# EAGLE design dynext_v0.2 (EAGLE 6.5.0)
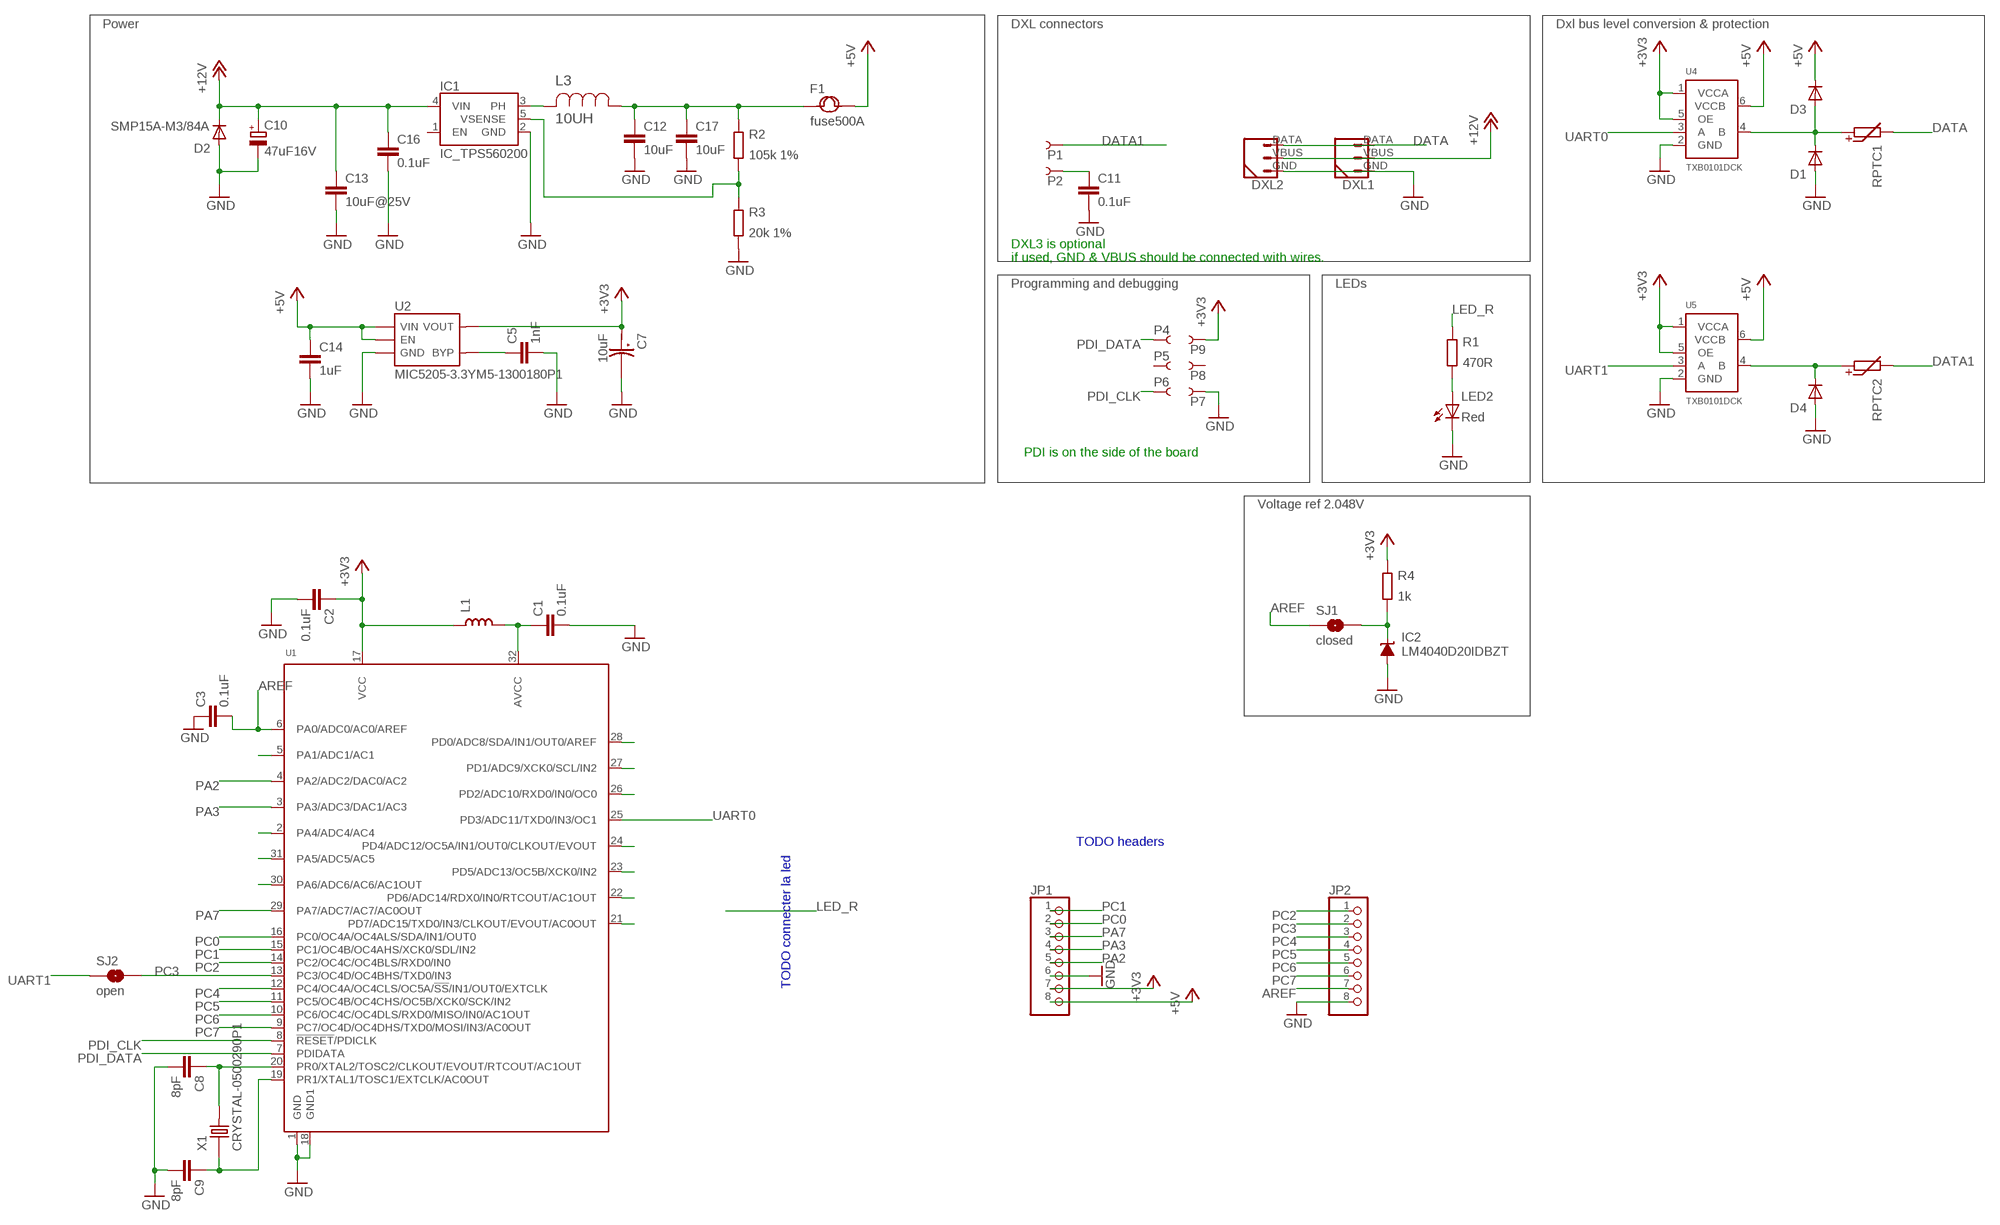
[diagram p0: schematic, sheet 1]

## Parts
C1  0.1uF  C0402  [0402_N]
C2  0.1uF  C0402  [0402_N]
C3  0.1uF  C0402  [0402_N]
C5  1nF  C0402  [0402_N]
C7  10uF  C-POLAR-A  [AVX-A]
C8  8pF  C0402  [0402_N]
C9  8pF  C0402  [0402_N]
C10  47uF16V  CPOL-EUUD-5X5,8  [UD-5X5,8_NICHICON]
C11  0.1uF  C0402  [0402_N]
C12  10uF  C0805  [0805_N]
C13  10uF@25V  C0805  [0805_N]
C14  1uF  C0402  [0402_N]
C16  0.1uF  C0402  [0402_N]
C17  10uF  C0805  [0805_N]
D1  DIODE-SOD523  [SOD-523_N]
D2  SMP15A-M3/84A  DIODE-SMP  [DO-220AA]
D3  DIODE-SOD523  [SOD-523_N]
D4  DIODE-SOD523  [SOD-523_N]
DXL1  DYNAMIXEL_3POS-T  [DYNAMIXEL_3POS_TOP]
DXL2  DYNAMIXEL_3POS-T  [DYNAMIXEL_3POS_TOP]
F1  fuse500A  FUSE-1206  [F1206]
IC1  IC_TPS560200  [SOT-23-5_N]
IC2  LM4040D20IDBZT  LM4041A12DBZ  [DBZ_R-PDSO-G3]
JP1  PINHD-1X8R  [1X08_ROUND]
JP2  PINHD-1X8R  [1X08_ROUND]
L1  L0603  [0603_N]
L3  10UH  ELL4LG100MA-4XG  [IND_ELL4XG]
LED2  Red  LED0603  [D_0603_N]
P1  PIN_SMD_2X2.5  [PIN_SMD_2X2.5]
P2  PIN_SMD_2X2.5  [PIN_SMD_2X2.5]
P4  PIN_SMD_2X2.5  [PIN_SMD_2X2.5]
P5  PIN_SMD_1X1  [PIN_SMD_1X1]
P6  PIN_SMD_2X2.5  [PIN_SMD_2X2.5]
P7  PIN_SMD_2X2.5  [PIN_SMD_2X2.5]
P8  PIN_SMD_1X1  [PIN_SMD_1X1]
P9  PIN_SMD_2X2.5  [PIN_SMD_2X2.5]
R1  470R  R0402  [0402_N]
R2  105k 1%  R0402  [0402_N]
R3  20k 1%  R0402  [0402_N]
R4  1k  R0402  [0402_N]
RPTC1  R-PTC0603  [0603_N]
RPTC2  R-PTC0603  [0603_N]
SJ1  closed  SOLDERJUMPER2_TRACE2  [SJ_2S-TRACE2]
SJ2  open  SOLDERJUMPER2NO  [SJ_2S-NO]
U1  ATXMEGAE5-MU_MOD  [QFN-32_50P_L_MOD]
U2  MIC5205-3.3YM5-1300180P1  [SOT23-5]
U4  TXB0101DCK  [SC70-6]
U5  TXB0101DCK  [SC70-6]
X1  CRYSTAL-0500290P1  [2P-SMD-5.0X3.2]

## Nets
+3V3: C2.1 C7.+ JP1.7 L1.1 P9.PIN R4.2 U1.17(VCC) U2.5(VOUT) U4.1(VCCA) U4.5(OE) U5.1(VCCA) U5.5(OE)
+5V: C14.1 D3.C F1.2 JP1.8 U2.1(VIN) U2.3(EN) U4.6(VCCB) U5.6(VCCB)
+12V: C10.+ C13.1 C16.1 D2.C DXL1.VBUS DXL2.VBUS IC1.4(VIN)
AREF: C3.2 JP2.7 SJ1.1 U1.6(PA0/ADC0/AC0/AREF)
DATA: DXL1.DATA DXL2.DATA RPTC1.2
DATA1: P1.PIN RPTC2.2
GND: C1.2 C2.2 C3.1 C5.2 C7.- C8.2 C9.2 C10.- C11.2 C12.2 C13.2 C14.2 C16.2 C17.2 D1.A D2.A D4.A DXL1.GND DXL2.GND IC1.2(GND) IC2.2(A) JP1.6 JP2.8 LED2.C P7.PIN R3.1 U1.1(GND) U1.18(GND1) U2.2(GND) U4.2(GND) U5.2(GND)
LED_R: R1.2
N$1: C11.1 P2.PIN
N$2: C1.1 L1.2 U1.32(AVCC)
N$3: LED2.A R1.1
N$4: C8.1 U1.20(PR0/XTAL2/TOSC2/CLKOUT/EVOUT/RTCOUT/AC1OUT) X1.2
N$5: C5.1 U2.4(BYP)
N$6: C9.1 U1.19(PR1/XTAL1/TOSC1/EXTCLK/AC0OUT) X1.1
N$7: D1.C D3.A RPTC1.1 U4.4(B)
N$8: U1.5(PA1/ADC1/AC1)
N$9: U1.2(PA4/ADC4/AC4)
N$10: U1.31(PA5/ADC5/AC5)
N$11: D4.C RPTC2.1 U5.4(B)
N$12: U1.30(PA6/ADC6/AC6/AC1OUT)
N$13: U1.21(PD7/ADC15/TXD0/IN3/CLKOUT/EVOUT/AC0OUT)
N$14: C12.1 C17.1 F1.1 L3.1 R2.2
N$15: IC1.5(VSENSE) R2.1 R3.2
N$16: U1.22(PD6/ADC14/RDX0/IN0/RTCOUT/AC1OUT)
N$17: U1.23(PD5/ADC13/OC5B/XCK0/IN2)
N$18: U1.24(PD4/ADC12/OC5A/IN1/OUT0/CLKOUT/EVOUT)
N$19: U1.26(PD2/ADC10/RXD0/IN0/OC0)
N$20: U1.27(PD1/ADC9/XCK0/SCL/IN2)
N$21: U1.28(PD0/ADC8/SDA/IN1/OUT0/AREF)
N$29: IC2.1(C) R4.1 SJ1.2
PA2: JP1.5 U1.4(PA2/ADC2/DAC0/AC2)
PA3: JP1.4 U1.3(PA3/ADC3/DAC1/AC3)
PA7: JP1.3 U1.29(PA7/ADC7/AC7/AC0OUT)
PC0: JP1.2 U1.16(PC0/OC4A/OC4ALS/SDA/IN1/OUT0)
PC1: JP1.1 U1.15(PC1/OC4B/OC4AHS/XCK0/SDL/IN2)
PC2: JP2.1 U1.14(PC2/OC4C/OC4BLS/RXD0/IN0)
PC3: JP2.2 SJ2.2 U1.13(PC3/OC4D/OC4BHS/TXD0/IN3)
PC4: JP2.3 U1.12(PC4/OC4A/OC4CLS/OC5A/!SS!/IN1/OUT0/EXTCLK)
PC5: JP2.4 U1.11(PC5/OC4B/OC4CHS/OC5B/XCK0/SCK/IN2)
PC6: JP2.5 U1.10(PC6/OC4C/OC4DLS/RXD0/MISO/IN0/AC1OUT)
PC7: JP2.6 U1.9(PC7/OC4D/OC4DHS/TXD0/MOSI/IN3/AC0OUT)
PDI_CLK: P6.PIN U1.8(!RESET!/PDICLK)
PDI_DATA: P4.PIN U1.7(PDIDATA)
PH_L: IC1.3(PH) L3.2
UART0: U1.25(PD3/ADC11/TXD0/IN3/OC1) U4.3(A)
UART1: SJ2.1 U5.3(A)
Unconnected: IC1.1(EN) P5.P$1 P8.P$1

## Notes on the sheet
- Power | DXL connectors | Dxl bus level conversion & protection
- DXL3 is optional 
  if used, GND & VBUS should be connected with wires.
- Programming and debugging | LEDs
- PDI is on the side of the board
- Voltage ref 2.048V
- TODO headers
- TODO connecter la led

## Library data of the parts
C1-C3 C5 C8 C9 C11-C14 C16 C17 = Xevelabs:C: Non-polarized Capacitor
C7 = OPL:C-POLAR*
C10 = rcl:CPOL-EU: POLARIZED CAPACITOR, European symbol
D1-D4 = Xevelabs:DIODE: Diode
DXL1 DXL2 = Xevelabs:DYNAMIXEL_3POS
F1 = OPL:FUSE*
IC1 = Xevelabs:IC_TPS560200
IC2 = texas:LM4041: PRECISION MICROPOWER SHUNT VOLTAGE REFERENCE Source: http://focus.ti.com/lit/ds/slcs146e/slcs146e.pdf; MPN: LM4041A12IDBZR; OC_FARNELL: 1407949; OC_NEWARK: 58K5875
JP1 JP2 = pinhead:PINHD-1X8: PIN HEADER
L1 = Xevelabs:L
L3 = Panasonic-ELL:ELL: Choke Coils; MPN: ELL4LG100MA; OC_FARNELL: 1717444; OC_NEWARK: 15R1065; PACKAGE-SIZE: 3.8X3.8X1.8MM; SUPPLIER: PANASONIC
LED2 = Xevelabs:LED: LED
P1 P2 P4-P9 = Xevelabs:PIN
R1-R4 = Xevelabs:R: Resistor
RPTC1 RPTC2 = Xevelabs:R-PTC: PTC (Positive Temperature Coefficient) Resistor
SJ1 SJ2 = Xevelabs:SOLDERJUMPER2: Solder Jumper Standard SMD solder jumper. Used to automate production. Two varients : Normally Open and Normally Closed are the same, but have different paste layers. NC will have a large amount of paste and should jumper during reflow.
U1 = dynext_v0.1:ATXMEGAE5
U2 = OPL:MIC5205-3.3YM5: The MIC5205 is an efficient linear voltage regulator with ultra-low-noise output, very low dropout voltage (typically 17mV at light loads and 165mV at 150mA), and very low ground current (600µA at 100mA output). The MIC5205 offers better than 1% initial accuracy. datasheet here: http://www.micrel.com/product-info/prod/5205.shtml
U4 U5 = MWquad_stuff:TXB0101
X1 = OPL:CRYSTAL*

## Board
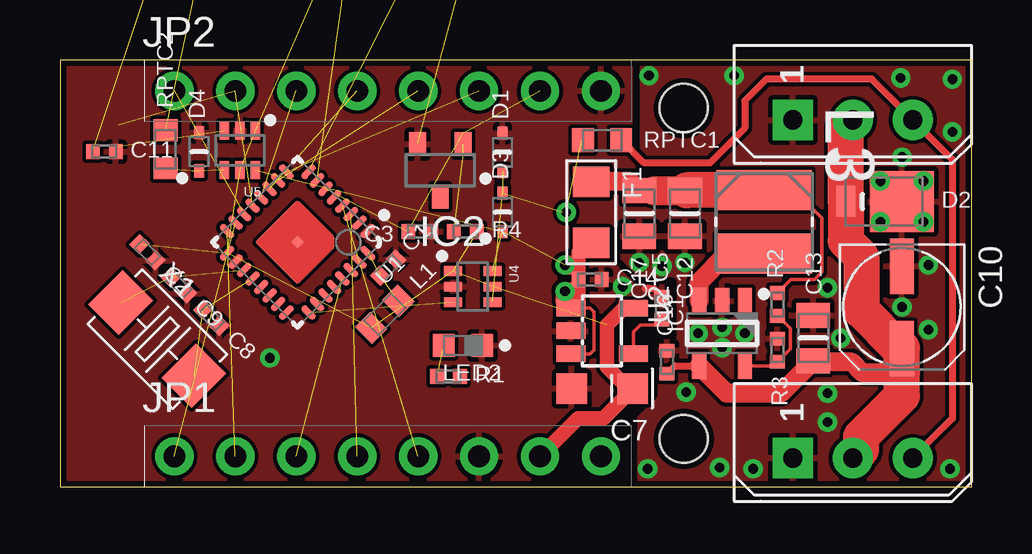
[diagram p1: board, top side]
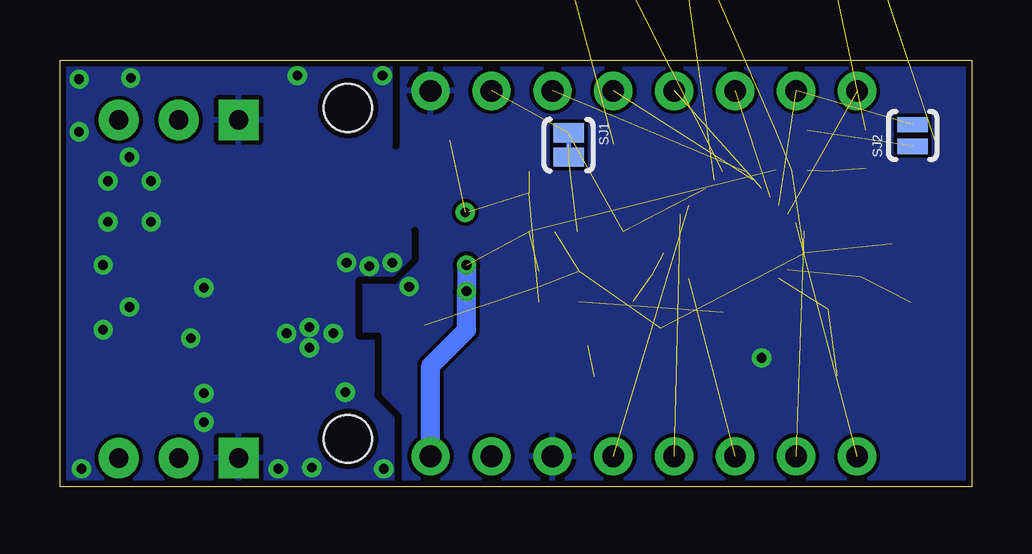
[diagram p2: board, bottom side, seen from below]

Size 38 x 17.8 mm. Coordinates in mm from the lower left corner, seen from the top.
Outline: 0,0 38,0 38,17.8 0,17.8 0,0
Copper layers (1*2*3*16): Top 0.035mm / dielectric 0.2mm / Route2 0.035mm / dielectric 1mm / Route3 0.035mm / dielectric 0.2mm / Bottom 0.035mm
Design rules "Xevelabs_6mil_eurocircuits *": minimum track width 0.15mm, minimum drill 0.25mm, track to track 0.155mm, track to pad 0.155mm, pad to pad 0.155mm, via to via 0.155mm, smd to smd 0mil, copper to edge 0.25mm, drill to drill 0.25mm, minimum pad ring 0mil, minimum via ring 0.2mm, stop-mask expansion 0mil, vias tented up to drill 100mil, thermal gap 0.2mm
Holes 2 mm at 26,2 26,15.8
tRestrict: 9 lines
bRestrict: 9 lines

### Footprints (pad centres in the part's own frame; a part is rotated, then mirrored left to right if it is on the bottom)
0402_N = smd 0.57 x 0.62: 1 -0.48,0; 2 0.48,0
AVX-A = smd 1.27 x 1.27: + -1.27,0; - 1.27,0
UD-5X5,8_NICHICON = smd 2.3 x 1: + 1.725,0; - -1.7,0
0805_N = smd 1.05 x 1.4: 1 -0.95,0; 2 0.95,0
SOD-523_N = smd 0.55 x 0.42: A 0.8,0; C -0.8,0
DO-220AA = smd 2.67 x 2.54: A 0.7,0 | smd 0.76 x 1.27: C -1.65,0
DYNAMIXEL_3POS_TOP = drill 0.8 pad 1.676: DATA 1.8,2.45; VBUS 1.8,4.95 | drill 0.8 pad 1.676 square: GND 1.8,7.45
F1206 = smd 1.27 x 1.524: 1 -1.27,0; 2 1.27,0
SOT-23-5_N = smd 1.1 x 0.6: 1 -1.35,0.95; 2 -1.35,0; 3 -1.35,-0.95; 4 1.35,-0.95; 5 1.35,0.95
DBZ_R-PDSO-G3 = smd 0.7 x 1: 1 -0.95,-1.1; 2 0.95,-1.1; 3 0,1.1
1X08_ROUND = drill 0.9 pad 1.6: 1 -8.89,0; 2 -6.35,0; 3 -3.81,0; 4 -1.27,0; 5 1.27,0; 6 3.81,0; 7 6.35,0; 8 8.89,0
0603_N = smd 0.9 x 1: 1 -0.8,0; 2 0.8,0
IND_ELL4XG = smd 1.651 x 3.988: 1 -1.321,0; 2 1.321,0
D_0603_N = smd 0.9 x 0.95: A 0.8,0; C -0.8,0
PIN_SMD_2X2.5 = smd 2.5 x 2: PIN 0,0
PIN_SMD_1X1 = smd 1 x 1: P$1 0,0
SJ_2S-TRACE2 = smd 0.8 x 1.27: 1 -0.508,0; 2 0.508,0
SJ_2S-NO = smd 0.635 x 1.27: 1 -0.45,0; 2 0.45,0
QFN-32_50P_L_MOD = smd 0.75 x 0.3: 1 -2.4,1.75; 2 -2.4,1.25; 3 -2.4,0.75; 4 -2.4,0.25; 5 -2.4,-0.25; 6 -2.4,-0.75; 7 -2.4,-1.25; 8 -2.4,-1.75; 17 2.4,-1.75; 18 2.4,-1.25; 19 2.4,-0.75; 20 2.4,-0.25; 21 2.4,0.25; 22 2.4,0.75; 23 2.4,1.25; 24 2.4,1.75 | smd 0.3 x 0.75: 9 -1.75,-2.4; 10 -1.25,-2.4; 11 -0.75,-2.4; 12 -0.25,-2.4; 13 0.25,-2.4; 14 0.75,-2.4; 15 1.25,-2.4; 16 1.75,-2.4; 25 1.75,2.4; 26 1.25,2.4; 27 0.75,2.4; 28 0.25,2.4; 29 -0.25,2.4; 30 -0.75,2.4; 31 -1.25,2.4; 32 -1.75,2.4 | smd 0.35 x 0.35: 33 0,0
SOT23-5 = smd 0.69 x 1.2: 1 -0.95,-1.3; 2 0,-1.3; 3 0.95,-1.3; 4 0.95,1.3; 5 -0.95,1.3
SC70-6 = smd 0.4 x 0.75: 1 -0.65,-0.825; 2 0,-0.825; 3 0.65,-0.825; 4 0.65,0.825; 5 0,0.825; 6 -0.65,0.825
2P-SMD-5.0X3.2 = smd 1.778 x 2.032: 1 -2.159,0; 2 2.159,0

### Placement (x,y rotation side)
C1  13.68,9.14 45 top
C2  3.65,9.78 315 top
C3  15,10.65 180 top
C5  25.1,7.45 90 top
C7  22.6,4.1 180 top
C8  6.31,7.06 315 top
C9  4.96,8.4 315 top
C10  35.1,7.5 270 top
C11  1.85,13.97 0 top
C12  26.05,11.4 270 top
C13  31.4,6.2 90 top
C14  22.1,8.65 0 top
C16  25.3,5.2 90 top
C17  24.15,11.4 270 top
D1  18.45,13.95 90 top
D2  34.4,11.9 0 top
D3  18.45,11.45 90 top
D4  5.8,13.97 90 top
DXL1  38,13.5 90 top
DXL2  38,-0.6 90 top
F1  22.15,11.45 270 top
IC1  27.6,6.4 270 top
IC2  15.85,13.2 180 top
JP1  13.66,1.27 0 top
JP2  13.66,16.51 0 top
L1  13.54,7.19 45 top
L3  29.35,11.05 270 top
LED2  16.8,5.9 180 top
P1  6.28,23.7 90 top  (outside the outline)
P2  6.28,28.7 90 top  (outside the outline)
P4  12.87,28.21 180 bottom  (outside the outline)
P5  15.41,28.21 270 bottom  (outside the outline)
P6  17.95,28.18 180 bottom  (outside the outline)
P7  17.95,25.67 0 bottom  (outside the outline)
P8  15.41,25.67 270 bottom  (outside the outline)
P9  12.87,25.67 180 bottom  (outside the outline)
R1  16.2,4.6 0 top
R2  29.9,7.6 90 top
R3  29.9,5.7 270 top
R4  16.9,10.65 0 top
RPTC1  22.6,14.45 0 top
RPTC2  4.4,14.07 90 top
SJ1  16.8,14.25 270 bottom
SJ2  2.45,14.65 90 bottom
U1  9.9,10.2 225 top
U2  22.6,6.5 270 top
U4  17.2,8.35 270 top
U5  7.5,14.03 180 top
X1  4.06,6.16 315 top

### Tracks (layer width: path | path; a pad name or v marks a point on that pad's centre or on a via)
+3V3  (9 unrouted)
  Top 0.6: U2.5 23.5,7.45 22.8,6.75 22.8,5 23.7,4.1 C7.+ 23.87,4.07 23.05,3.25 22.66,2.85 21.59,2.85 JP1.7
+5V  (via drill 0.4)  (3 unrouted)
  Top 0.15: U2.3 22.1,5.55 22.25,5.7 22.25,7.3 22.1,7.45 U2.1 21.1,7.65 21.1,7.8
  Top 0.6: U2.1 21.62,7.45 C14.1 21.62,9.77 21.73,9.77 F1.2
  Top 0.8: 21.45,8.15 v21.05,8.15 21.05,7.8 21.1,7.8 | v21.05,9.25 21.45,9.25
  Bottom 0.8: JP1.8 22.55,5.05 21.05,6.55 v21.05,8.15 v21.05,9.25
+12V
  Top 0.3: C16.1 25.63,5.05 IC1.4
  Top 0.8: IC1.4 27.8,3.9 30.05,3.9 C13.1 31.45,5.2 33,5.2 33.45,4.75 35.1,4.75 | 35.08,5.8 C10.+
  Top 1.5: DXL1.VBUS 32.75,15 D2.C 32.75,10.25 33.4,9.6 33.4,7.35 34.98,5.78 C10.+ 35.1,4.75 35.1,3.8 33.4,2.1 33.4,1.55 DXL2.VBUS
AREF  (3 unrouted)
DATA
  Top 0.3: DXL2.DATA 37.2,2.85 37.2,13.65 DXL1.DATA 33.85,17 29.45,17 28.55,16.1 28.55,14.95 27.1,13.5 24.35,13.5 RPTC1.2
DATA1  (1 unrouted)
GND  (via drill 0.4)  (1 unrouted)
  Top 0.3: C5.2 24.78,8.25 24.4,8.25
  other vias: 32,8.3 27.6,6.65 26.6,6.4 28.55,6.4 32.55,6.2 36.2,9.25 35.1,7.5 27.5,0.8 32,2.7 32,3.9 24.5,0.75 28.9,0.75 37.2,17 24.15,9.35 25.1,9.2 26.05,9.35 37.1,0.75 26.1,3.95 35.1,13.75 28.1,17.15 24.55,17.15 35.05,17.05 37.2,14.8 36.2,6.55 34.2,12.75 34.2,11.05 36,12.75 36,11.05 27.6,5.8 23.45,8.35 8.75,5.38
  pour Top (rank 3): -0.35,18.12 38.85,18.2 38.45,-0.33 -0.28,-0.3
  pour Bottom: -0.28,18.05 38.5,18.05 38.55,-0.42 -0.3,-0.4
N$1  (1 unrouted)
N$2  (2 unrouted)
N$3  (1 unrouted)
N$4  (2 unrouted)
N$5
  Top 0.15: U2.4 23.9,6.45 24.2,6.75 24.88,6.75 C5.1
N$6  (2 unrouted)
N$7  (via drill 0.4)  (4 unrouted)
  Top 0.3: RPTC1.1 21.75,14.45
  Bottom 0.3: v21.1,11.45 20.98,11.45
N$11  (2 unrouted)
N$14
  Top 0.15: R2.2 30.47,8.65 31.45,8.65 31.75,8.95 31.75,11.2 30.58,12.37 L3.1
  Top 0.8: C12.1 26.11,12.35 26.13,12.37 | 24.77,12.35 C17.1 23.78,12.72 F1.1
  Top 1.2: 24.77,12.35 C12.1
  Top 1.5: L3.1 26.13,12.37
N$15
  Top 0.15: R2.1 29.93,7.12 30.45,6.6 30.45,5.75 29.92,5.22 R3.2 29.73,5.05 IC1.5
N$29  (2 unrouted)
PA2  (1 unrouted)
PA3  (1 unrouted)
PA7  (1 unrouted)
PC0  (1 unrouted)
PC1  (1 unrouted)
PC2  (1 unrouted)
PC3  (2 unrouted)
PC4  (1 unrouted)
PC5  (1 unrouted)
PC6  (1 unrouted)
PC7  (1 unrouted)
PDI_CLK  (1 unrouted)
PDI_DATA  (1 unrouted)
PH_L
  Top 0.8: IC1.3 26.65,8.55 27.8,9.7 29.32,9.7 L3.2
UART0  (1 unrouted)
UART1  (1 unrouted)